# Altium schematic sheet usb_to_full_duplex_rs485.SchDoc
size A4
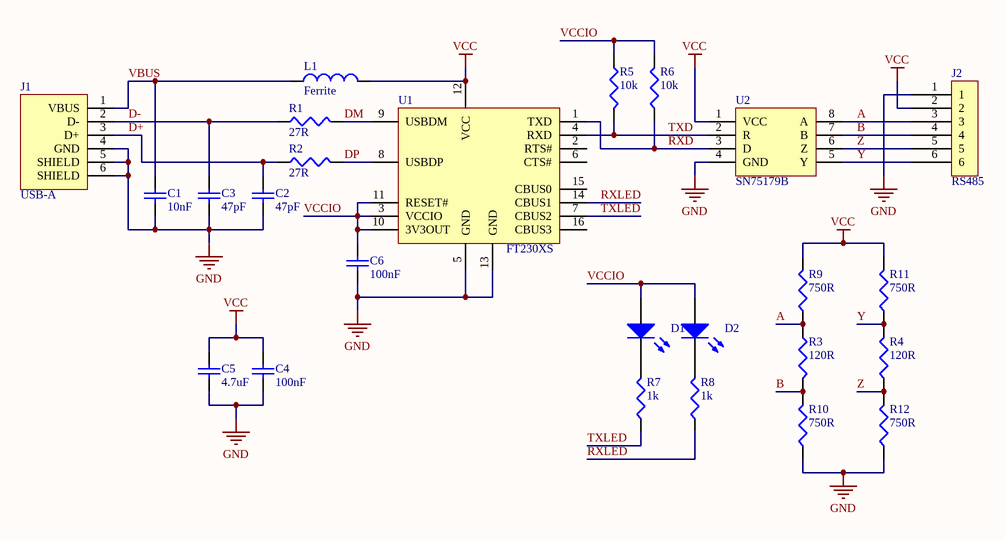
[diagram p0: usb_to_full_duplex_rs485.SchDoc]

## Parts
C1  10nF  [1608[0603]]
C2  47pF  [1608[0603]]
C3  47pF  [1608[0603]]
C4  100nF  [1608[0603]]
C5  4.7uF  [1608[0603]]
C6  100nF  [1608[0603]]
D1  LED2  [1608[0603]]  (value not drawn)
D2  LED2  [1608[0603]]  (value not drawn)
J1  USB-A  [USB-A-PLUG]
J2  RS485  [MICRO-MATCH-6]
L1  Ferrite  [INDC1608L]
R1  27R  [J1-0603]
R2  27R  [J1-0603]
R3  120R  [J1-0603]
R4  120R  [J1-0603]
R5  10k  [J1-0603]
R6  10k  [J1-0603]
R7  1k  [J1-0603]
R8  1k  [J1-0603]
R9  750R  [J1-0603]
R10  750R  [J1-0603]
R11  750R  [J1-0603]
R12  750R  [J1-0603]
U1  FT230XS  [SOP64P600X175-16N]
U2  SN75179B  [SOIC-8]

## Nets
GND: C1.2 C2.1 C3.2 C4.2 C5.1 C6.1 J1.4(GND) J1.5(SHIELD) J1.6(SHIELD) J2.1 R10.1 R12.1 U1.5(GND) U1.13(GND) U2.4(GND)
VCC: C4.1 C5.2 J2.2 L1.2 R9.2 R11.2 U1.12(VCC) U2.1(VCC)
A: J2.3 R3.1 R9.1 U2.8(A)
B: J2.4 R3.2 R10.2 U2.7(B)
D+: C2.2 J1.3(D+) R2.1
D-: C3.1 J1.2(D-) R1.1
DM: R1.2 U1.9(USBDM)
DP: R2.2 U1.8(USBDP)
RXD: R6.1 U1.1(TXD) U2.3(D)
RXLED: R8.1 U1.14(CBUS1)
TXD: R5.2 U1.4(RXD) U2.2(R)
TXLED: R7.1 U1.7(CBUS2)
VBUS: C1.1 J1.1(VBUS) L1.1
VCCIO: C6.2 D1.1(A) D2.1(A) R5.1 R6.2 U1.3(VCCIO) U1.10(3V3OUT) U1.11(RESET#)
Y: J2.6 R4.2 R11.1 U2.5(Y)
Z: J2.5 R4.1 R12.2 U2.6(Z)
NetD1_2: D1.2(K) R7.2
NetD2_2: D2.2(K) R8.2

Not connected (* = marked no-connect by the designer): U1 2(RTS#) 6(CTS#) 15(CBUS0) 16(CBUS3)

## Library data of the parts
C1-C6 = Cap Semi: Capacitor (Semiconductor SIM Model); Value: 100pF; Published: 8-Jun-2000; LatestRevisionDate: 29-May-2009; LatestRevisionNote: IPC-7351 Footprint Added.; PackageReference: C1206; Publisher: Altium Limited; PackageDescription: Chip Capacitor
D1 D2 = LED2: Typical RED, GREEN, YELLOW, AMBER GaAs LED; Published: 8-Jun-2000; LatestRevisionDate: 17-Jul-2002; LatestRevisionNote: Re-released for DXP Platform.; PackageVersion: Feb-2002; PackageReference: 3.2X1.6X1.1; Publisher: Altium Limited; PackageDescription: SM LED; 2 Flat Leads
J2 = HEADER-6
L1 = Inductor: Code_IEC: 1005; Value: 10mH; Published: 8-Jun-2000; LatestRevisionDate: 29-May-2009; LatestRevisionNote: IPC-7351 Footprint Added.; PackageReference: 0402-A; Publisher: Altium Limited; PackageDescription: Chip Inductor; Code_JEITA: 0402
R1-R6 R9-R12 = Res3: Resistor; Value: 1K; Published: 8-Jun-2000; LatestRevisionDate: 29-May-2009; LatestRevisionNote: IPC-7351 Footprint Added.; PackageReference: J1-0603; Publisher: Altium Limited; PackageDescription: Chip Resistor
R7 R8 = Res3: Resistor; Published: 8-Jun-2000; LatestRevisionDate: 29-May-2009; LatestRevisionNote: IPC-7351 Footprint Added.; PackageReference: J1-0603; Publisher: Altium Limited; PackageDescription: Chip Resistor; Value: 1K